# Altium schematic sheet PCB_Schematic.SchDoc
size A4; SheetNumber: 1; SheetTotal: 1
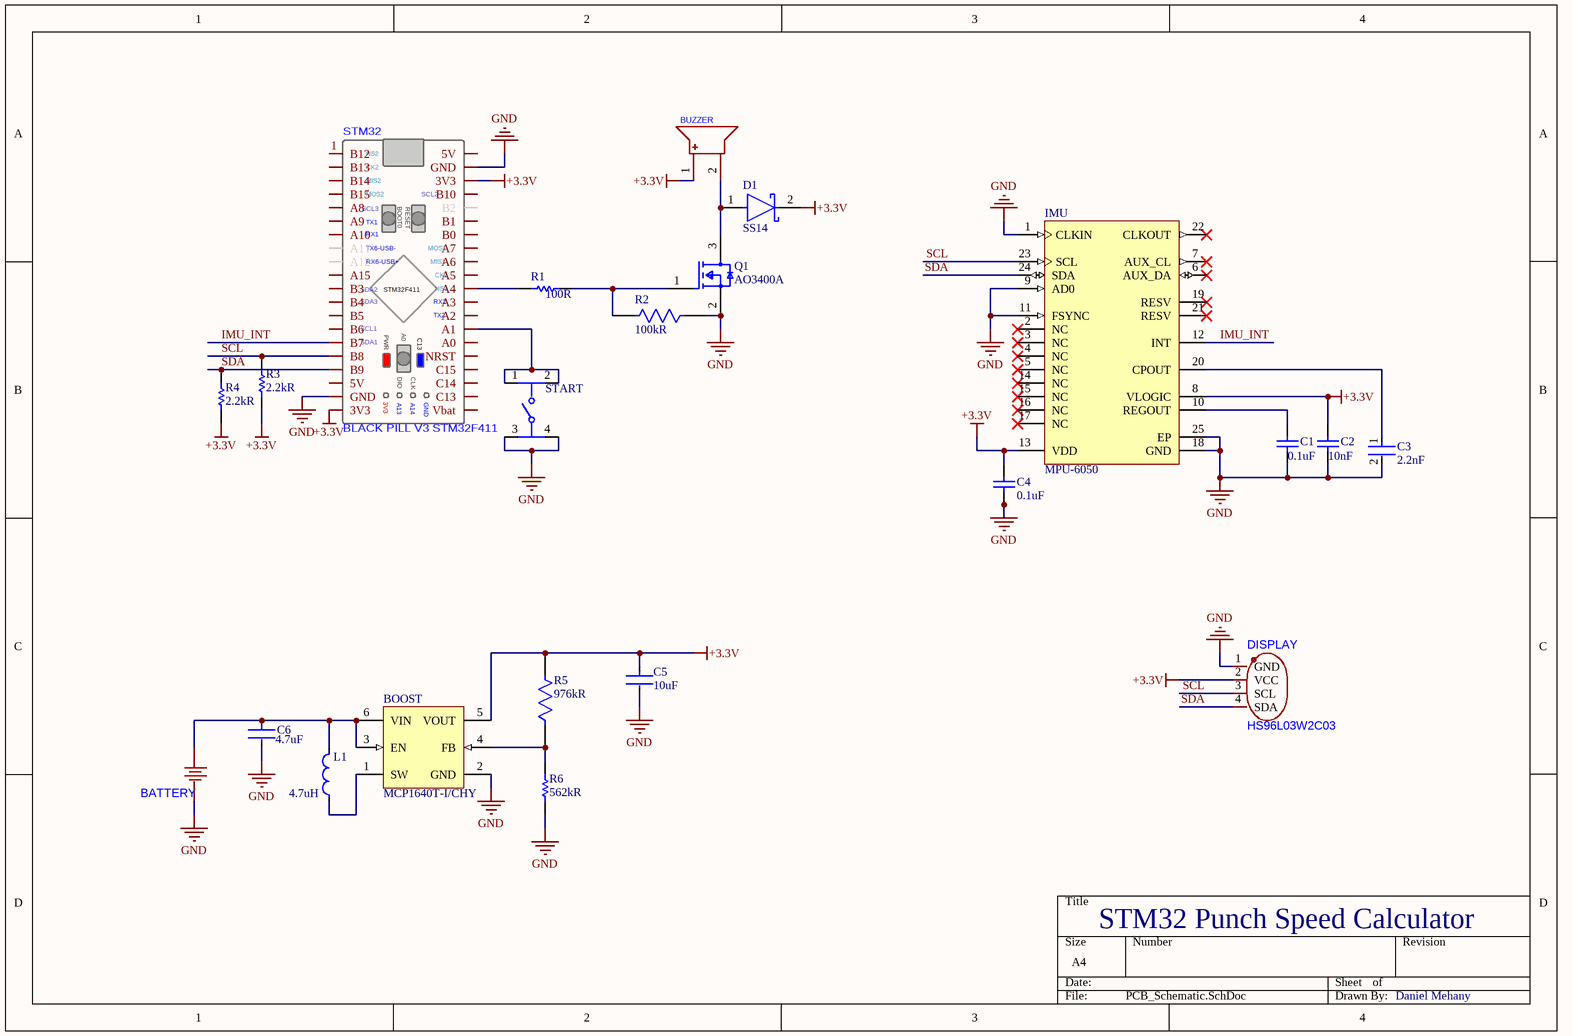
[diagram p0: PCB_Schematic.SchDoc]

## Parts
BATTERY  BH-AAA-B5BA021  [BAT-SMD_BH-AAA-B5BA021]  (value not drawn)
BOOST  MCP1640T-I/CHY  [MCHP-SOT-23-CHY6_N]
BUZZER  2.7kHz  [BUZ-SMD_L9.6-W9.6-LS10.0-R]  (value not drawn)
C1  cap: 0.1uF  [CAPC1050X55X23ML05T13]  (hidden comment: CL05B104KO5NNNC)
C2  10nF  [CAPC2013X75X45LL10T25]
C3  2.2nF  [FP-C2012-060-0_2-IPC_B]
C4  cap: 0.1uF  [CAPC1050X55X23ML05T13]  (hidden comment: CL05B104KO5NNNC)
C5  value 10uF  [FP-CL31-IPC_C]  (hidden comment: CL31A106KBHNNNE)
C6  4.7uF  [FP-CL21-IPC_A]
D1  SS14  [FP-403AE-MFG]
DISPLAY  HS96L03W2C03  [OLED-TH_L27.8-W27.2-P2.54_C9900033791]
IMU  MPU-6050  [IS-QFN-24_V]
L1  4.7uH  [FP-LQM21PH_G0-IPC_C]
Q1  AO3400A  [FP-SOT23-MFG]
R1  100R  [RESC1609X50X30ML8T20]
R2  value 100kR  [FP-CRCW0603-HPe3-IPC_C]  (hidden comment: 0603WAF1003T5E)
R3  2.2kR  [RESC1609X50X30NL10T20]
R4  2.2kR  [RESC1609X50X30NL10T20]
R5  976kR  [FP-AC0603-MFG]
R6  562kR  [RESC1608X55X25NL10T15]
START  START  [FP-PTS645SM43SMTR92LFS-MFG]  (value not drawn)
STM32  BLACK PILL V3 STM32F411  [BLACK PILL V3]

## Nets
+3.3V: BOOST.5(VOUT) BUZZER.1 C2.2 C4.2 C5.1 D1.2(C) DISPLAY.2(VCC) IMU.8(VLOGIC) IMU.13(VDD) R3.1 R4.1 R5.2 STM32.20(3V3) STM32.23(3V3)
GND: BATTERY.2 BOOST.2(GND) C1.1 C2.1 C3.2 C4.1 C5.2 C6.2 DISPLAY.1(GND) IMU.1(CLKIN) IMU.9(AD0) IMU.11(FSYNC) IMU.18(GND) IMU.25(EP) Q1.2(S) R2.1 R6.1 START.3 START.4 STM32.19(GND) STM32.22(GND)
IMU_INT: IMU.12(INT) STM32.15(B7)
SCL: DISPLAY.3(SCL) IMU.23(SCL) R3.2 STM32.16(B8)
SDA: DISPLAY.4(SDA) IMU.24(SDA) R4.2 STM32.17(B9)
NetBATTERY_1: BATTERY.1 BOOST.3(EN) BOOST.6(VIN) C6.1 L1.2
NetBOOST_1: BOOST.1(SW) L1.1
NetBOOST_4: BOOST.4(FB) R5.1 R6.2
NetBUZZER_2: BUZZER.2 D1.1(A) Q1.3(D)
NetC1_2: C1.2 IMU.10(REGOUT)
NetC3_1: C3.1 IMU.20(CPOUT)
NetQ1_1: Q1.1(G) R1.2 R2.2
NetR1_1: R1.1 STM32.31(A4)
NetSTART_1: START.1 START.2 STM32.34(A1)

Not connected (* = marked no-connect by the designer): IMU 2(NC)* 3(NC)* 4(NC)* 5(NC)* 6(AUX_DA)* 7(AUX_CL)* 14(NC)* 15(NC)* 16(NC)* 17(NC)* 19(RESV)* 21(RESV)* 22(CLKOUT)*; STM32 1(B12) 2(B13) 3(B14) 4(B15) 5(A8) 6(A9) 7(A10) 8(A11) 9(A12) 10(A15) 11(B3) 12(B4) 13(B5) 14(B6) 18(5V) 21(5V) 24(B10) 25(B2) 26(B1) 27(B0) 28(A7) 29(A6) 30(A5) 32(A3) 33(A2) 35(A0) 36(NRST) 37(C15) 38(C14) 39(C13) 40(Vbat)

## Notes on the sheet
- STM32 Punch Speed Calculator
- Daniel Mehany
- (in symbol BLACK PILL V3 STM32F411) NS2; CK2; MIS2; MOS2; SCL2; BOOT0; RESET; SCL3; TX1; RX1; TX6-USB-; MOS1; RX6-USB+; MIS1; CK1; SDA2; STM32F411; NS1; SDA3; RX2; TX2; SCL1; PWR; SDA1; DIO; CLK; A13; A14

## Library data of the parts
BATTERY = BH-AAA-B5BA021: Manufacturer: MYOUNG(美阳); Add into BOM: yes; Connector Type: Battery Holder; Battery Type: AAA; Symbol: BH-AAA-B5BA021; Device: BH-AAA-B5BA021; LCSC Part Name: 电池盒 适用电池:7号; Supplier Part: C7525446; Manufacturer Part: BH-AAA-B5BA021; Supplier Footprint: SMD; JLCPCB Part Class: Extended Part; Datasheet: https://item.szlcsc.com/datasheet/BH-AAA-B5BA021/8619513.html; Supplier: LCSC; Convert to PCB: yes; Contact Material: Phosphor Bronze; Contact Plating: Gold; Operating Temperature: -25℃~+85℃; JLCPCB Part #: C7525446
BOOST = CMP-0139-00282-1: Start-up Synchronous Boost Regulator with True Output Disconnect or Input / Output Bypass Option, 350 mA, Input Voltage 0.65 to 5.5 V, Output Voltage 2.0 to 5.5 V, -40 to 85 degC, 6-pin SOT-23 (CHY6), Tape and Reel; Manufacturer: Microchip; ComponentLink3URL: http://www.microchip.com/stellent/groups/techpub_sg/documents/packagingspec/en012702.pdf; ComponentLink2Description: Datasheet; ComponentLink3Description: Package Specification; Mounting Technology: Surface Mount; ComponentLink2URL: http://ww1.microchip.com/downloads/en/DeviceDoc/22234B.pdf; PackageReference: SOT-23-CHY6; ComponentLink4URL: http://www.microchip.com/MCP1640; PartNumber: MCP1640T-I/CHY; PackageDescription: 6-Lead Plastic Small Outline Transistor, 2.9 x 1.55 mm Body, 0.95 mm Pitch; ComponentLink1Description: Manufacturer URL; DatasheetVersion: Rev. B; PackageVersion: C04-028B; ComponentLink1URL: http://www.microchip.com; ComponentLink4Description: Product URL; JLCPCB Part #: C44365
BUZZER = MLT-9650: Manufacturer: 华能; Symbol: HND-9650B; Add into BOM: yes; Driver Circuitry: Active Buzzer (Built-in Driving Circuit); Voltage - Supply: 3V~7V; Sound Pressure Level(SPL): 85dB; Device: MLT-9650; LCSC Part Name: 耐环保MLT-9650; Supplier Part: C96127; Manufacturer Part: MLT-9650; Supplier Footprint: -; JLCPCB Part Class: Extended Part; Datasheet: https://atta.szlcsc.com/upload/public/pdf/source/20170914/C96127_1505374148680969227.pdf; Supplier: LCSC; Convert to PCB: yes; Technology: Electromagnetic; Value: 2.7kHz; Length: 9.6mm; Width: 9.6mm; Height: 5.5mm; JLCPCB Part #: C96127
C1 C4 = CMP-2000-05439-1: Chip Capacitor, 100 nF, +/- 10%, 16 V, -55 to 125 degC, 0402 (1005 Metric), RoHS, Tape and Reel; Manufacturer: Samsung Electro-Mechanics; Capacitance: 100000pF; Dielectric: X7R; Rated Voltage: 16V; Case Size/Dimension: 0402; Tolerance (%): ±10%; Manufacturer URL: http://www.samsungsem.com/global/index.jsp; Datasheet URL: https://datasheet.ciiva.com/29198/458718-da-01-en-vs-kondensator-0402-29198423.pdf; Datasheet Version: Nov-10; JLCPCB Part #: C1525
C2 = CMP-2000-06105-1: Multilayer Ceramic Capacitor, 10 nF, 50 V, -55 to 125 degC, 2-Pin SMD, RoHS, Tape and Reel / CL21B103KBANNNC; Manufacturer: Samsung Electro-Mechanics; Capacitance: 10000pF; Tolerance (%): ±10%; Dielectric: X7R; Rated Voltage: 50V; Package Description: 2-Pin Surface Mount Device, Body 2 x 1.25 mm; Datasheet Version: 11/2010; Package Reference: 0805; Case Size/Dimension: 0805; Datasheet URL: https://datasheet.ciiva.com/29199/455082-da-01-en-vs-kondensator-0805-29199459.pdf; Mounting Technology: SurfaceMount; Manufacturer URL: http://www.samsungsem.com/global/index.jsp; JLCPCB Part #: C1710
C3 = CMP-08246-003906-1: Multilayer Ceramic Capacitors 2.2nF ±5% 50V C0G SMD 0805; Temperature Coefficient: 30ppm/°C; Length: 2mm; Package Quantity: 1; Height: 0.6mm; Case Code (Imperial): 0805; Voltage: 50V; Thickness: 0.028inch; Min Operating Temperature: -55°C; RoHS Compliant: Yes; Voltage Rating: 50V; Tolerance: 5%; Packaging: Tape and Reel; Weight: 0.000194oz; Case/Package: 0805; Max Operating Temperature: 125°C; Width: 0.049inch; Dielectric Material: Ceramic; Construction: Flat; Depth: 1.25mm; value: 2.2nF; Termination: SMD/SMT; Voltage Rating (DC): 50V; Mount: Surface Mount; Case Code (Metric): 2012; Lead Free: Lead Free; Series: C; Dielectric: C0G; JLCPCB Part #: C28260
C5 = CMP-13271-000016-1: CAP CER 10UF 50V X5R 1206; Manufacturer: Samsung; Tolerance: 10%; Material: Ceramic; Temperature Coefficient: 15%; RoHS: TRUE; Ipc Land Pattern Name: CAPC320160X160; Temperature Range Low: -55°C; Device Class L3: Ceramic Capacitors; Category: Cap; Temperature Characteristic: X5R; Lead Free: Yes; Device Class L2: Capacitors; Octopart: https://octopart.com/cl31a106kbhnnne-samsung-19832778; ComponentLink2Description: Datasheet; Digikey Description: CAP CER 10UF 50V X5R 1206; Voltage: 50V; ComponentLink2URL: http://www.samsungsem.com/kr/support/product-search/mlcc/__icsFiles/afieldfile/2018/06/21/CL31A106KBHNNNE.pdf; Capacitance: 10uF; Manufacturer Part Number: CL31A106KBHNNNE; Temperature Range High: +85°C; Device Class L1: Passive Components; Height: 1.8mm; Automotive: No; Voltage Rating: 50V; Package: CL31; Temperature: -55°C to +85°C; JLCPCB Part #: C13585
C6 = CMP-13271-002624-1: CL21 Series 0805 4.7uF 25V ±10% Tolerance X5R Multilayer Ceramic Chip Capacitor; Case Code (Imperial): 0805; Thickness: 0.055inch; Mount: Surface Mount; Case Code (Metric): 2012; Capacitance: 4.7uF; Depth: 1.25mm; Lead Free: Lead Free; Case/Package: 0805; Voltage Rating: 25V; Package Quantity: 1; Width: 0.049inch; Radiation Hardening: No; Voltage Rating (DC): 25V; Length: 2mm; Dielectric: X5R; Height: 1.25mm; Packaging: Tape and Reel; Tolerance: 10%; Min Operating Temperature: -55°C; Max Operating Temperature: 85°C; JLCPCB Part #: C1779
D1 = CMP-2000-04943-2: DIODE SCHOTTKY 40V 1A SMA; Manufacturer: ON Semiconductor; Peak Reverse Current: 0.2mA; Max Junction Temp: +125°C; Standoff Height: 0.05mm; Max Surge Forward Current: 40A; Mouser Description: Schottky Diodes & Rectifiers SMA 40V 1.0A; RoHS: TRUE; Lead Free: Yes; Manufacturer Part Number: SS14; Device Class L3: Schottky Diodes; Category: Diode; Automotive: No; Digikey Description: DIODE SCHOTTKY 40V 1A SMA; ComponentLink2Description: Datasheet; Device Class L2: Diodes; Height: 2.5mm; Temperature Range High: +125°C; ComponentLink2URL: https://www.onsemi.com/pub/Collateral/SS19-D.PDF; Device Class L1: Discrete Semiconductors; Package: 403AE; Octopart: https://octopart.com/ss14-on+semiconductor-29205033; Max Repetitive Reverse Voltage: 40V; Temperature Range Low: -65°C; Forward Current: 1A; Temperature: -65°C to +125°C; JLCPCB Part #: C2480
DISPLAY = HS96L03W2C03: Manufacturer: HS(汉昇); Add into BOM: yes; Main Control Chip: SSD1315; Interface Type: I2C; Pixel Resolution: 128x64; Symbol: HS96L03W2C03; Device: HS96L03W2C03; LCSC Part Name: 0.96寸OLED显示屏窄白光IIC; Supplier Part: C5248080; Manufacturer Part: HS96L03W2C03; Supplier Footprint: -; JLCPCB Part Class: Extended Part; Datasheet: https://atta.szlcsc.com/upload/public/pdf/source/20230627/763D01F79A90007632F098068C7C8AD9.pdf; Supplier: LCSC; Convert to PCB: yes; Size: 0.96; Operating Temperature: -40℃~+70℃; JLCPCB Part #: C5248080
IMU = CMP-1753-00002-2: 3-Axis Gyroscope, Accelerometer and a Digital Motion Processor(TM) (DMP), 2.375 to 3.46 V, -40 to 85 degC, 24-Pin QFN, RoHS, Tape and Reel; Manufacturer: InvenSense; Featured Product: MPU-60506-Axis,IntegratedI²CSolution; Other Names: 1428-1007-2 / MPU6050; Sensor Type: MotionTracking; Online Catalog: MPU-6000™Series; Unit PriceUSD: Digital; Datasheet Version: Rev. 3.3, 05/2012; Category: Sensors,Transducers; Datasheet URL: http://datasheet.octopart.com/MPU-6050-InvenSense-datasheet-14421344.pdf; Family: Multifunction; Standard Package: 5,000; Manufacturer URL: http://www.invensense.com/; Output Type: Digital; Dynamic Catalog: MPU-6000™Series; JLCPCB Part #: C24112
L1 = CMP-06042-017025-1: Multilayer Type Inductor for Power Lines, 0805 (2012), 4.7μH, 20%, 0.288Ω, 0.8A; Core Material: Ferrite; Self Resonant Frequency: 30MHz; DC Resistance (DCR): 288mR; Test Frequency: 1MHz; Shielding: Shielded; Current Rating: 800mA; Mount: Surface Mount; Package Quantity: 4000; Case/Package: 0805; Length: 0.079inch; Packaging: Cut Tape; Height - Seated (Max): 0.039inch; Case Code (Metric): 2012; Case Code (Imperial): 0805; Width: 0.049inch; Max Operating Temperature: 125°C; RoHS Compliant: Yes; Tolerance: 20%; Min Operating Temperature: -55°C; value: 4.7uH; JLCPCB Part #: C86090
Q1 = CMP-83955-000006-1: MOSFET N-CH 30V 5.7A SOT23; Input Capacitance: 630pF; Number of Elements: 1; Rds On Max: 26.5mR; Max Power Dissipation: 1.4W; Gate to Source Voltage (Vgs): 12V; Min Operating Temperature: -55°C; Lead Free: Lead Free; Number of Pins: 3; Drain to Source Voltage (Vdss): 30V; Case/Package: SOT-23; Mount: Surface Mount; Continuous Drain Current (ID): 5.7A; Radiation Hardening: No; Packaging: Tape and Reel; Max Operating Temperature: 150°C; Power Dissipation: 1.4W; JLCPCB Part #: C20917
R1 = CMP-2000-03824-5: Chip Resistor, 100 Ohm, +/- 1%, 100 mW,-55 to 155 degC, 0603 (1608 Metric), RoHS, Tape and Ree; Manufacturer: Vishay Semiconductor; ComponentLink2URL: http://www.vishay.com/docs/20035/dcrcwe3.pdf; ComponentLink1URL: http://www.vishay.com/; Mounting Technology: Surface Mount; ComponentLink1Description: Manufacturer URL; ComponentLink2Description: Datasheet; PackageDescription: 2-Pin Surface Mount Device, Body 1.575 x 0.85 mm; PackageReference: 0603; DatasheetVersion: 06/2012; JLCPCB Part #: C22775
R2 = CMP-02407-007815-1: RES Thick Film, 100kΩ, 1%, 0.33W, 100ppm/°C, 0603; Manufacturer: Uniroyal; Power Rating: 250mW; Voltage Rating: 75V; Min Operating Temperature: -55°C; Case/Package: 0603; Composition: Thick Film; Military Standard: Not; Temperature Coefficient: 100ppm/°C; Lead Free: Lead Free; Weight: 7.1E-05oz; Contact Plating: Tin; Width: 0.8mm; Length: 1.6mm; Radiation Hardening: No; Tolerance: 1%; Case Code (Metric): 1608; Features: Automotive AEC-Q200; Packaging: Tape and Reel; Max Power Dissipation: 250mW; Voltage Rating (DC): 75V; Resistance: 100kR; Height: 0.45mm; Case Code (Imperial): 0603; Number of Terminations: 2; Depth: 0.85mm; Max Operating Temperature: 155°C; Package Quantity: 10; Termination: SMD/SMT; Manufacturer Part Number: 0603WAF1003T5E; JLCPCB Part #: C25803
R3 R4 = CMP-2000-03167-1: Part Number: CRCW06032K20FKEA; Manufacturer: Vishay Dale; JLCPCB Part #: C4190
R5 = CMP-03412-021215-2: RES 976KΩ 1.00% 0.1W 0603; Max Power Dissipation: 100mW; Temperature Coefficient: 100ppm/°C; Tolerance: 1%; Number of Terminations: 2; Width: 0.031inch; Length: 0.063inch; Resistor Type: Thick Film; Resistance: 976kR; Min Operating Temperature: -55°C; Height: 0.022inch; Packaging: Tape and Reel; Series: AC; Case/Package: 0603; Max Operating Temperature: 155°C; Features: Moisture Resistant; RoHS Compliant: Yes; JLCPCB Part #: C48922
R6 = CMP-1659-00023-2: Chip Resistor, 562 KOhm, +/- 1%, 0.1 W, -55 to 155 degC, 0603 (1608 Metric), RoHS, Tape and Reel; Current Rating: 8 A; Voltage Rating: 160 V; ComponentLink2Description: Datasheet; Diameter: 7.25 mm; Pins: 2; Length: 7 mm; Height: 9.2 mm; Colour: Green; Packaging: Bulk; Weight: 4 oz; RoHSCompliant: true; PackageDescription: 2-Pin Surface Mount Device, Body 1.6 x 0.8 mm; ComponentLink1Description: Manufacturer URL; ComponentLink1URL: http://www.yageo.com/; Lead Pitch: 0.15 inch; PackageReference: 0603; Package Quantity: 50; DatasheetVersion: Rev. 4, 02/2016; Contact Plating: Tin; Mount: Through Hole; ComponentLink2URL: http://www.yageo.com/documents/recent/PYu-RC_Group_51_RoHS_L_04.pdf; JLCPCB Part #: C185319
START = CMP-2000-05160-2: SWITCH TACTILE SPST-NO 0.05A 12V; Contact Resistance: 100mR; Throw Configuration: SPST; Illumination Type: Non-Illuminated; Mechanical Life: 100000Cycles; Current Rating: 50mA; Switch Function: Off-Mom; Actuator Length: 0.85mm; Actuator Material: Nylon; Actuator Type: Standard; Operating Force: 160gf; Min Operating Temperature: -20°C; REACH SVHC: No SVHC; Termination: Gull Wing; Case/Package: SMD/SMT; Packaging: Tape and Reel; Mount: Surface Mount; Voltage Rating (DC): 12V; Orientation: Straight; Lead Free: Lead Free; Contact Material: Silver; Color: Black; Max Current Rating: 50mA; Contact Plating: Silver; Depth: 9mm; Package Quantity: 1; Max Voltage Rating (DC): 12V; Length: 6mm; Max Operating Temperature: 60°C; JLCPCB Part #: C221880